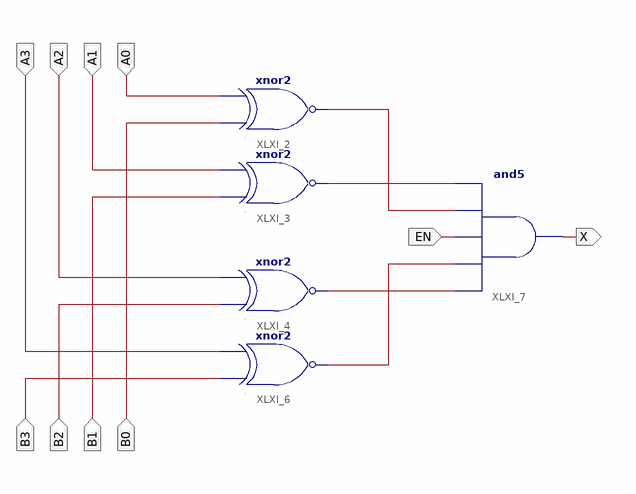
[diagram p0: schematic sheet 1]
// Xilinx ISE schematic Comparator.sch (spartan6) as structural Verilog: 5 symbols, 10 ports
module Comparator (
  input  A0,
  input  B0,
  input  A1,
  input  B1,
  input  A2,
  input  A3,
  input  B2,
  input  B3,
  input  EN,
  output X
);

  wire XLXN_13, XLXN_14, XLXN_15, XLXN_16;

  xnor XLXI_2 (XLXN_15, B0, A0);
  xnor XLXI_3 (XLXN_14, B1, A1);
  and XLXI_7 (X, XLXN_13, XLXN_16, EN, XLXN_15, XLXN_14);
  xnor XLXI_4 (XLXN_13, B2, A2);
  xnor XLXI_6 (XLXN_16, B3, A3);
endmodule
